# Altium schematic sheet 扩展板.SchDoc
size A4
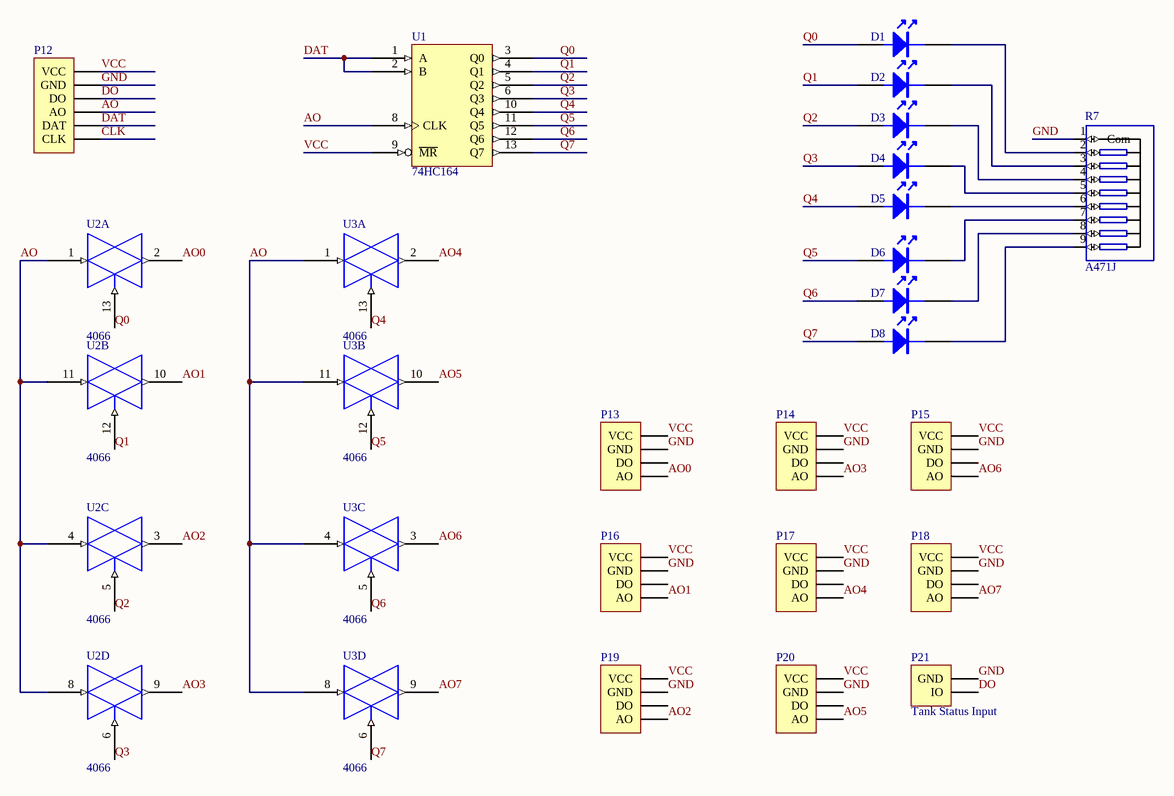
[diagram p0: 扩展板.SchDoc]

## Parts
D1  (no value)  [DIODE0.4A]
D2  (no value)  [DIODE0.4A]
D3  (no value)  [DIODE0.4A]
D4  (no value)  [DIODE0.4A]
D5  (no value)  [DIODE0.4A]
D6  (no value)  [DIODE0.4A]
D7  (no value)  [DIODE0.4A]
D8  (no value)  [DIODE0.4A]
P12  (no value)  [HDR1X6]
P13  (no value)  [HDR1X4]
P14  (no value)  [HDR1X4]
P15  (no value)  [HDR1X4]
P16  (no value)  [HDR1X4]
P17  (no value)  [HDR1X4]
P18  (no value)  [HDR1X4]
P19  (no value)  [HDR1X4]
P20  (no value)  [HDR1X4]
P21  Tank Status Input  [HDR1X2]
R7  A471J  [SIP9]
U1  74HC164  [DIP-14]
U2  4066  [DIP-14]  (parts A,B,C,D of 4)
U3  4066  [DIP-14]  (parts A,B,C,D of 4)

## Nets
GND: P12.2(GND) P13.2(GND) P14.2(GND) P15.2(GND) P16.2(GND) P17.2(GND) P18.2(GND) P19.2(GND) P20.2(GND) P21.1(GND) R7.1(Com) U1.7(GND) U2.7(GND) U3.7(GND)
VCC: P12.1(VCC) P13.1(VCC) P14.1(VCC) P15.1(VCC) P16.1(VCC) P17.1(VCC) P18.1(VCC) P19.1(VCC) P20.1(VCC) U1.9(~{MR}) U1.14(VCC) U2.14(VCC) U3.14(VCC)
AO: P12.4(AO) U1.8(CLK) U2.1 U2.4 U2.8 U2.11 U3.1 U3.4 U3.8 U3.11
AO0: P13.4(AO) U2.2
AO1: P16.4(AO) U2.10
AO2: P19.4(AO) U2.3
AO3: P14.4(AO) U2.9
AO4: P17.4(AO) U3.2
AO5: P20.4(AO) U3.10
AO6: P15.4(AO) U3.3
AO7: P18.4(AO) U3.9
CLK: P12.6(CLK)
DAT: P12.5(DAT) U1.1(A) U1.2(B)
DO: P12.3(DO) P21.2(IO)
Q0: D1.A U1.3(Q0) U2.13
Q1: D2.A U1.4(Q1) U2.12
Q2: D3.A U1.5(Q2) U2.5
Q3: D4.A U1.6(Q3) U2.6
Q4: D5.A U1.10(Q4) U3.13
Q5: D6.A U1.11(Q5) U3.12
Q6: D7.A U1.12(Q6) U3.5
Q7: D8.A U1.13(Q7) U3.6
NetD1_K: D1.K R7.2
NetD2_K: D2.K R7.3
NetD3_K: D3.K R7.4
NetD4_K: D4.K R7.5
NetD5_K: D5.K R7.6
NetD6_K: D6.K R7.7
NetD7_K: D7.K R7.8
NetD8_K: D8.K R7.9

Not connected (* = marked no-connect by the designer): P13 3(DO); P14 3(DO); P15 3(DO); P16 3(DO); P17 3(DO); P18 3(DO); P19 3(DO); P20 3(DO)

## Library data of the parts
D1-D8 = 发光二极管
P12 = Header 6: Header, 6-Pin; LatestRevisionDate: 17-Jul-2002; LatestRevisionNote: Re-released for DXP Platform.; Publisher: Altium Limited
P13-P20 = Header 4: Header, 4-Pin; LatestRevisionDate: 17-Jul-2002; LatestRevisionNote: Re-released for DXP Platform.; Publisher: Altium Limited
P21 = Header 2: Header, 2-Pin; LatestRevisionDate: 17-Jul-2002; LatestRevisionNote: Re-released for DXP Platform.; Publisher: Altium Limited
R7 = RE
U1 = 74HC
U2 U3 = 4